# Altium schematic sheet Sobel_FPGA_Block (1).SchDoc
size A1; SheetNumber: 1; SheetTotal: 1
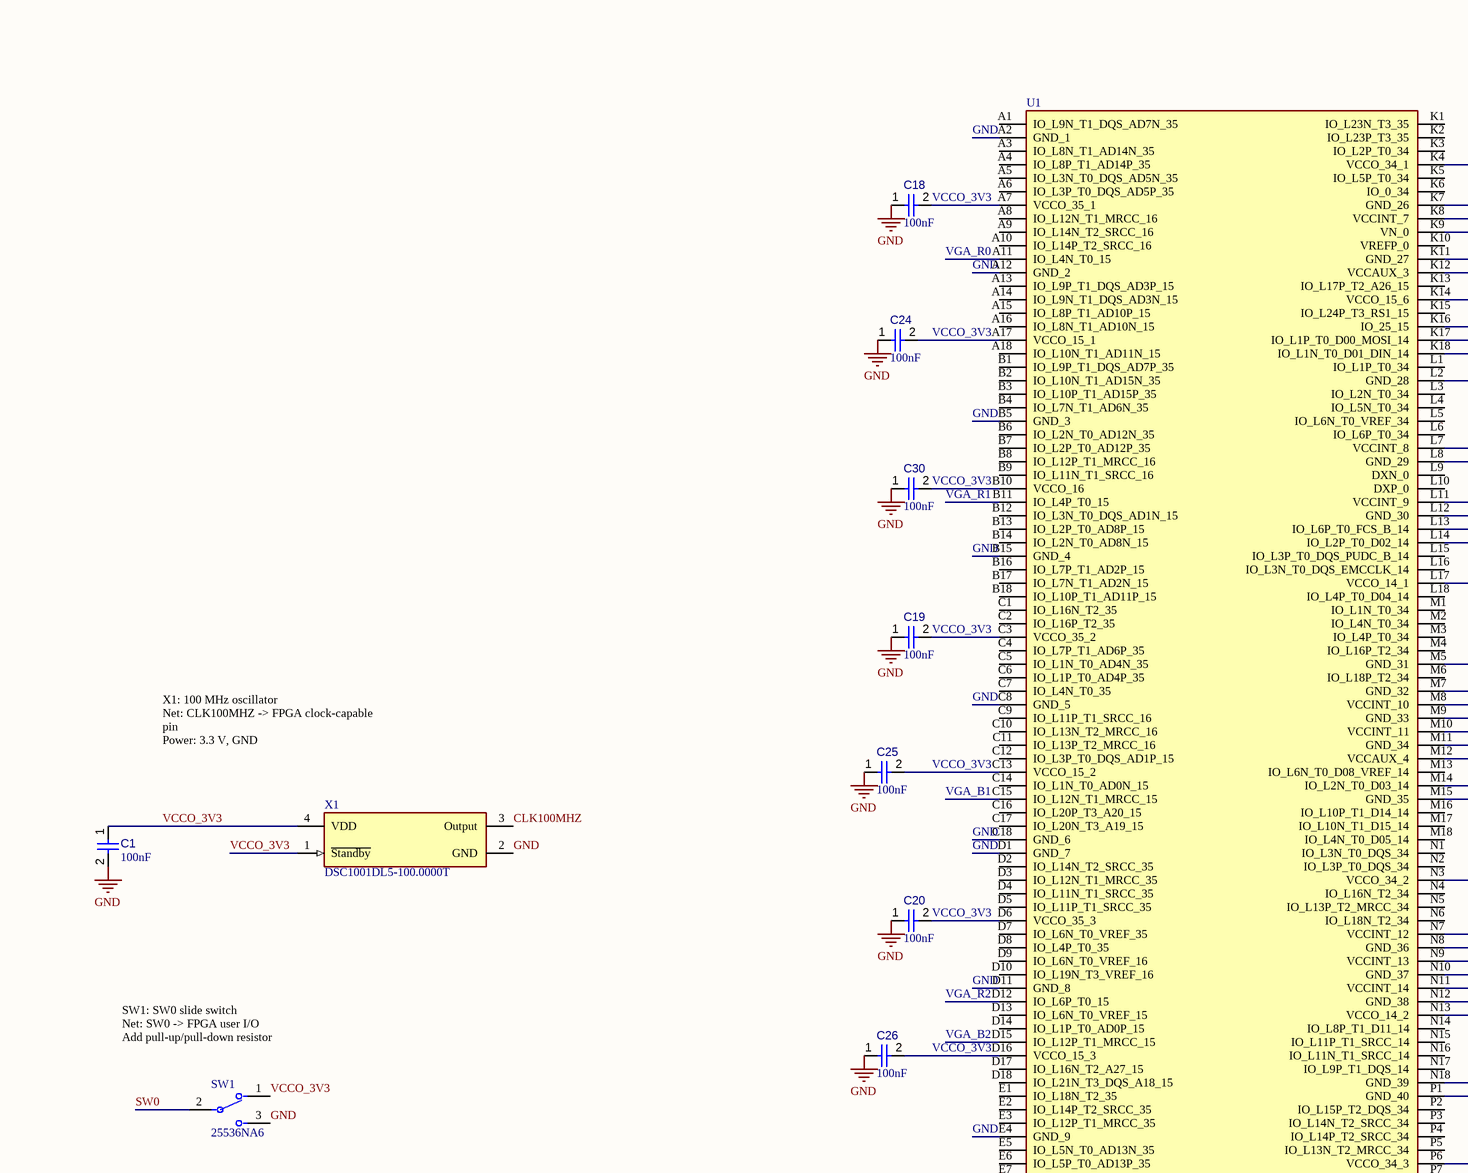
[diagram p0: Sobel_FPGA_Block (1).SchDoc, top left]
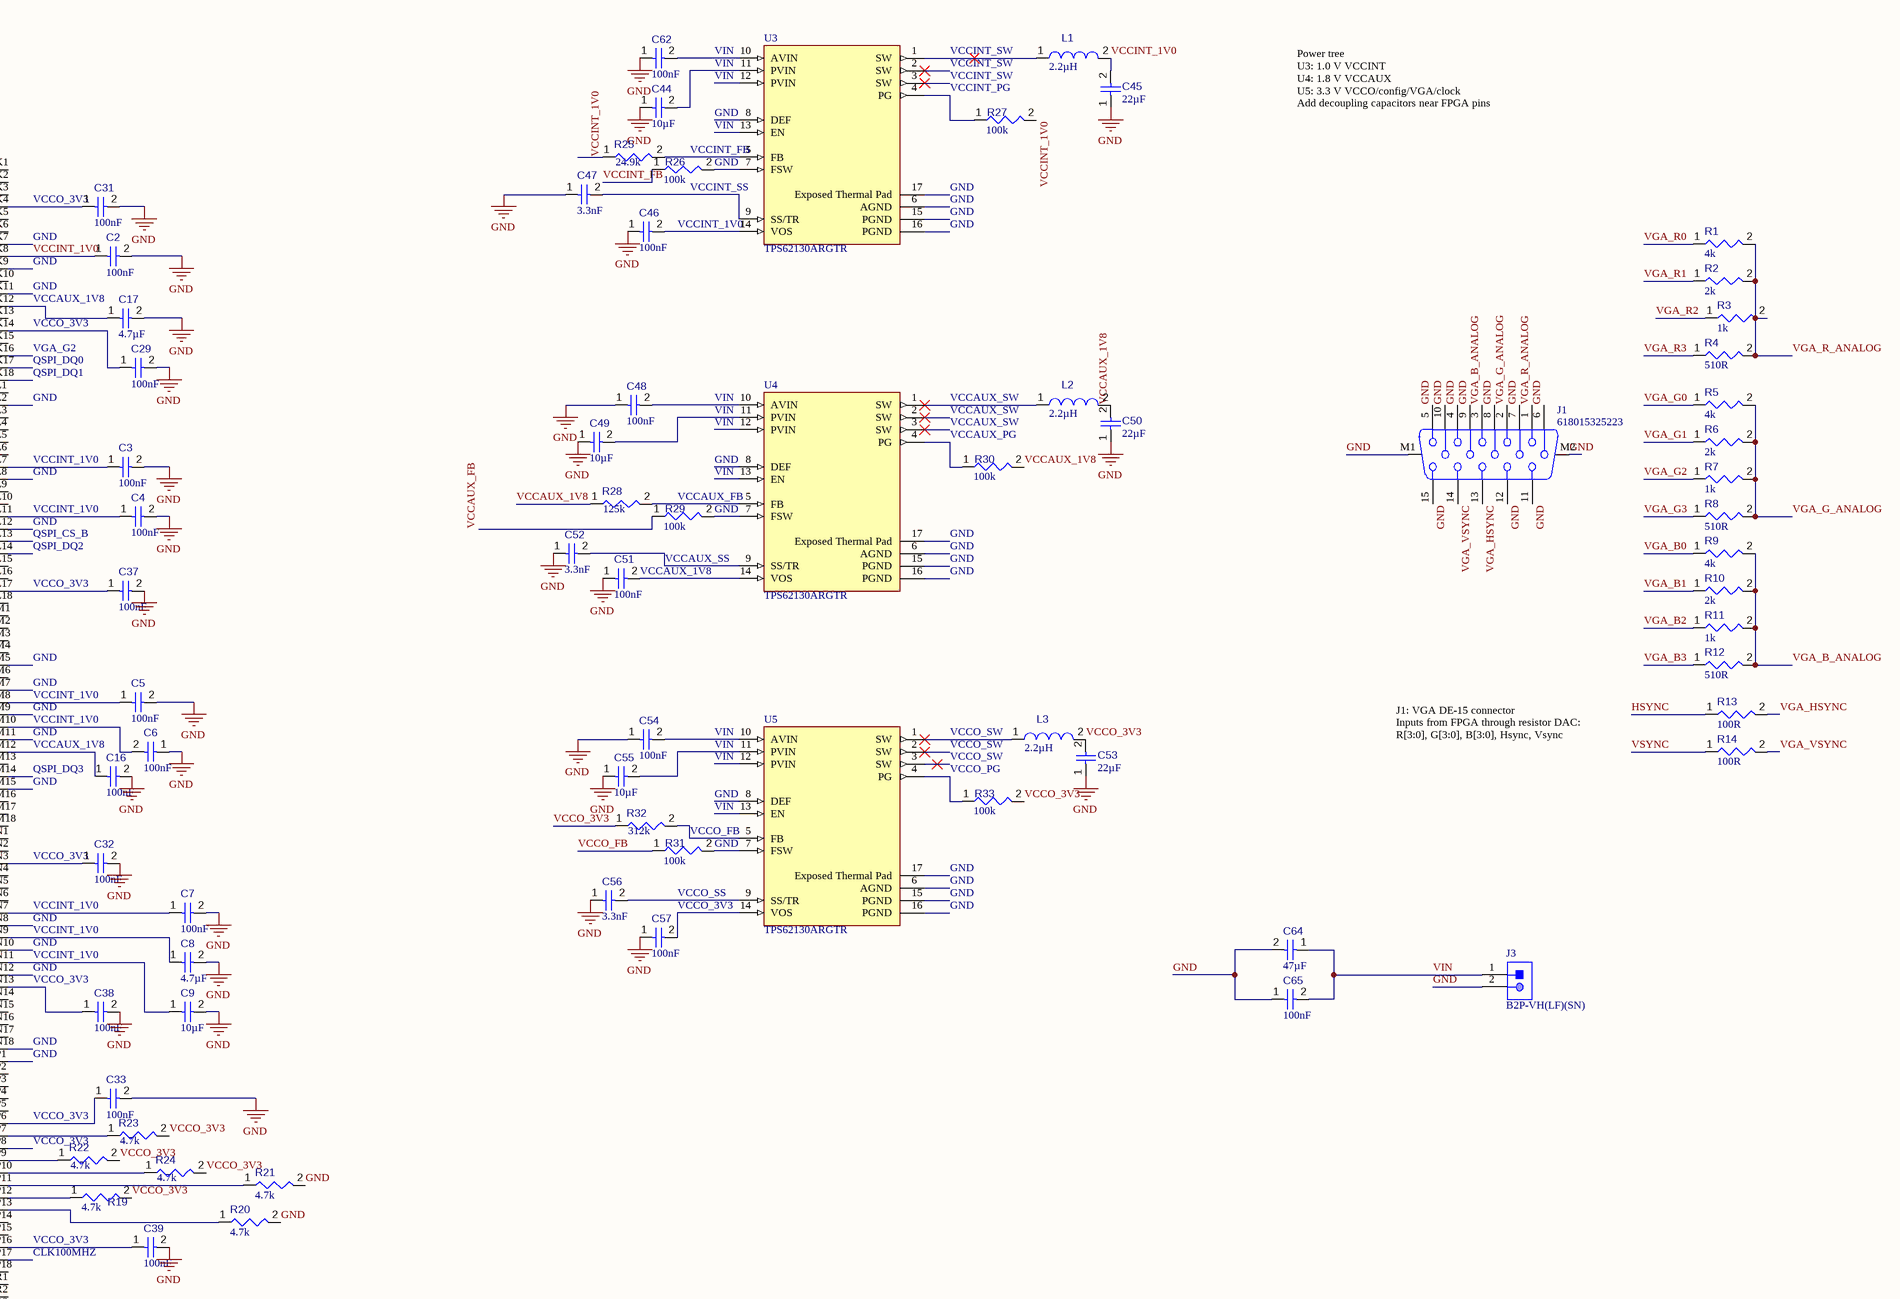
[diagram p1: Sobel_FPGA_Block (1).SchDoc, top right]
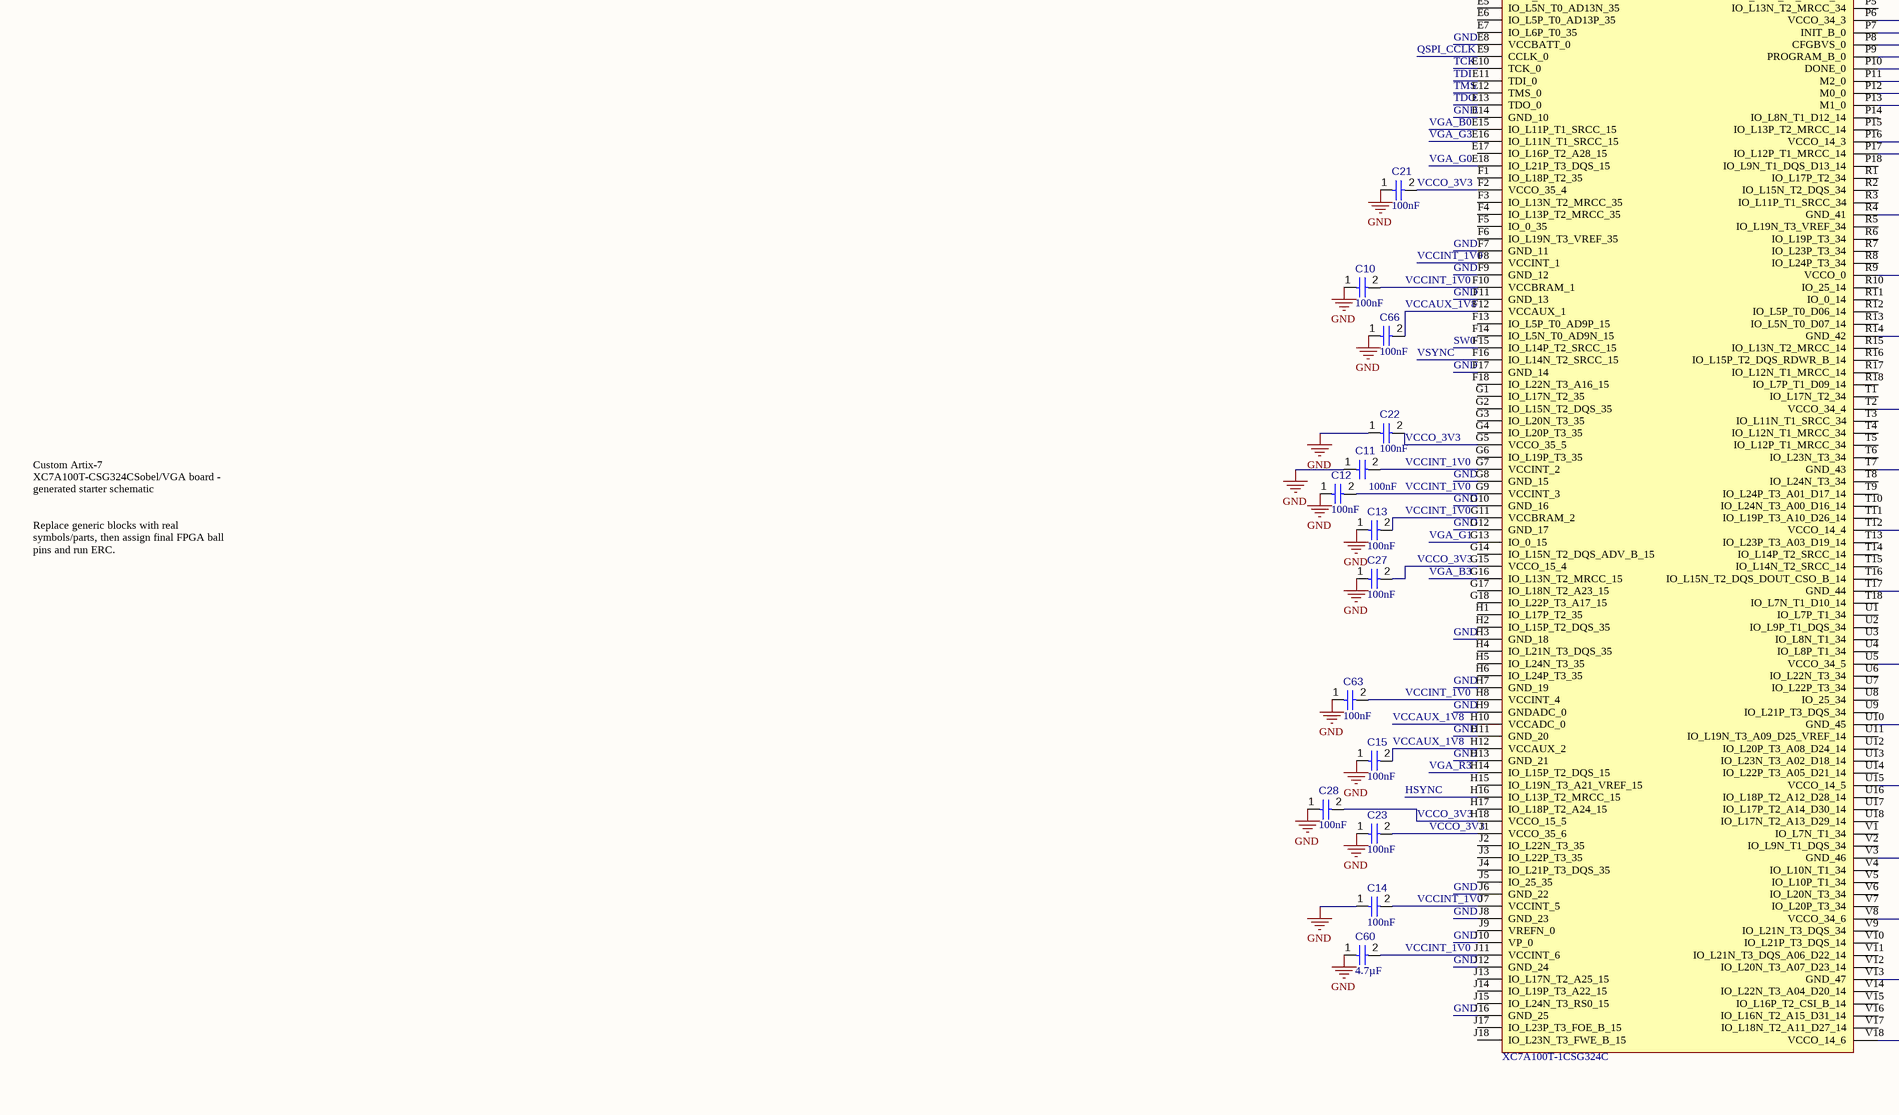
[diagram p2: Sobel_FPGA_Block (1).SchDoc, bottom left]
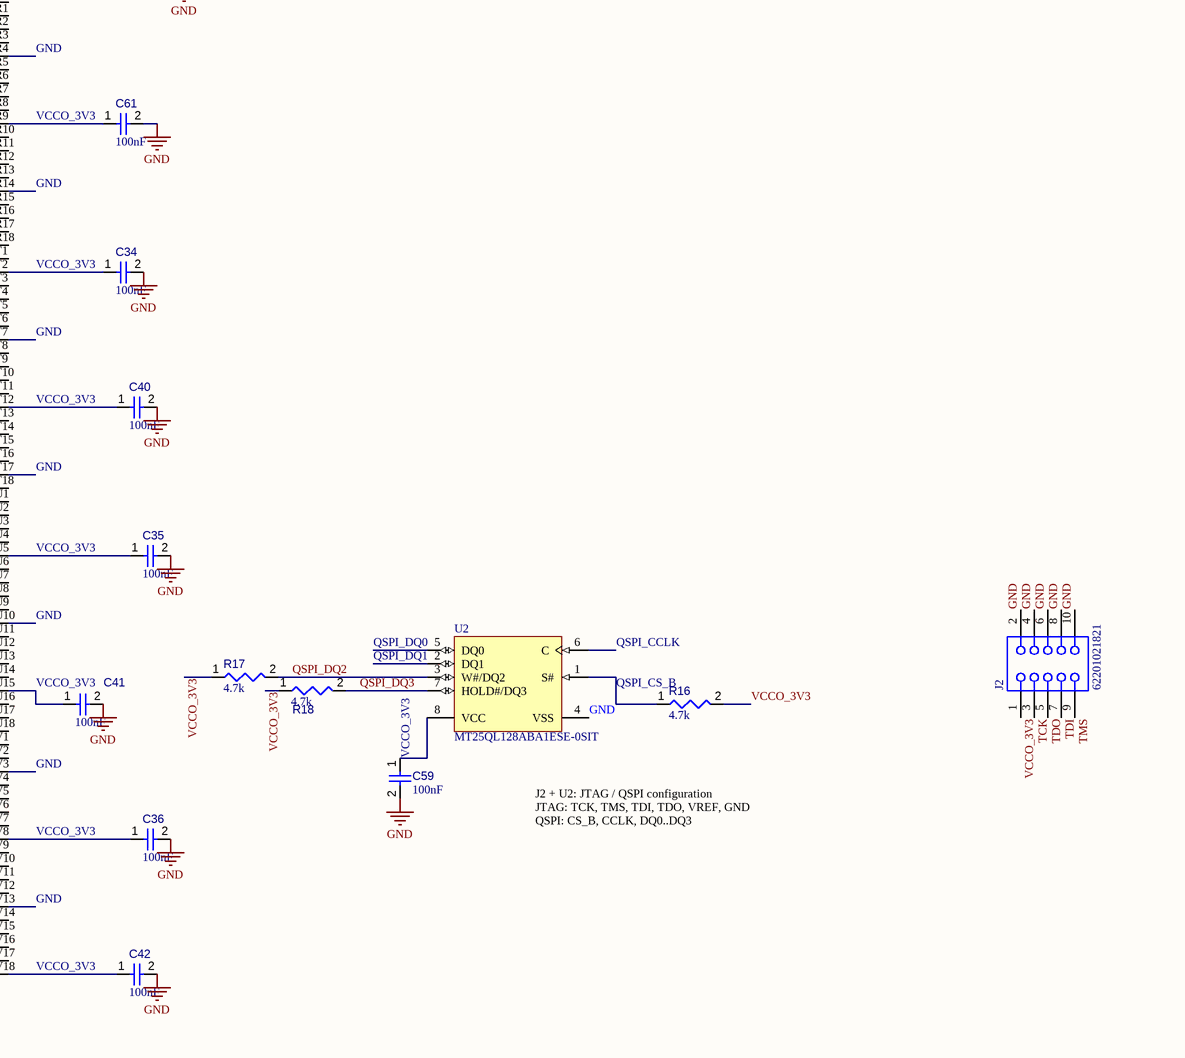
[diagram p3: Sobel_FPGA_Block (1).SchDoc, bottom right]

## Parts
C1  value 100nF  [CAPC1005X56X25NL10T15]  (hidden comment: Capacitor 6.8 nF +/- 10% 16 V 0402)
C2  value 100nF  [CAPC1005X56X25NL10T15]  (hidden comment: Capacitor 6.8 nF +/- 10% 16 V 0402)
C3  value 100nF  [CAPC1005X56X25NL10T15]  (hidden comment: Capacitor 6.8 nF +/- 10% 16 V 0402)
C4  value 100nF  [CAPC1005X56X25NL10T15]  (hidden comment: Capacitor 6.8 nF +/- 10% 16 V 0402)
C5  value 100nF  [CAPC1005X56X25NL10T15]  (hidden comment: Capacitor 6.8 nF +/- 10% 16 V 0402)
C6  value 100nF  [CAPC1005X56X25NL10T15]  (hidden comment: Capacitor 6.8 nF +/- 10% 16 V 0402)
C7  value 100nF  [CAPC1005X56X25NL10T15]  (hidden comment: Capacitor 6.8 nF +/- 10% 16 V 0402)
C8  value 4.7µF  [CAPC3216X180X50NL20T25]  (hidden comment: Capacitor 10 uF +/- 10% 16 V 1206)
C9  value 10µF  [CAPC3216X180X50NL20T25]  (hidden comment: Capacitor 10 uF +/- 10% 16 V 1206)
C10  value 100nF  [CAPC1005X56X25NL10T15]  (hidden comment: Capacitor 6.8 nF +/- 10% 16 V 0402)
C11  value 100nF  [CAPC1005X56X25NL10T15]  (hidden comment: Capacitor 6.8 nF +/- 10% 16 V 0402)
C12  value 100nF  [CAPC1005X56X25NL10T15]  (hidden comment: Capacitor 6.8 nF +/- 10% 16 V 0402)
C13  value 100nF  [CAPC1005X56X25NL10T15]  (hidden comment: Capacitor 6.8 nF +/- 10% 16 V 0402)
C14  value 100nF  [CAPC1005X56X25NL10T15]  (hidden comment: Capacitor 6.8 nF +/- 10% 16 V 0402)
C15  value 100nF  [CAPC1005X56X25NL10T15]  (hidden comment: Capacitor 6.8 nF +/- 10% 16 V 0402)
C16  value 100nF  [CAPC1005X56X25NL10T15]  (hidden comment: Capacitor 6.8 nF +/- 10% 16 V 0402)
C17  value 4.7µF  [CAPC3216X180X50NL20T25]  (hidden comment: Capacitor 10 uF +/- 10% 16 V 1206)
C18  value 100nF  [CAPC1005X56X25NL10T15]  (hidden comment: Capacitor 6.8 nF +/- 10% 16 V 0402)
C19  value 100nF  [CAPC1005X56X25NL10T15]  (hidden comment: Capacitor 6.8 nF +/- 10% 16 V 0402)
C20  value 100nF  [CAPC1005X56X25NL10T15]  (hidden comment: Capacitor 6.8 nF +/- 10% 16 V 0402)
C21  value 100nF  [CAPC1005X56X25NL10T15]  (hidden comment: Capacitor 6.8 nF +/- 10% 16 V 0402)
C22  value 100nF  [CAPC1005X56X25NL10T15]  (hidden comment: Capacitor 6.8 nF +/- 10% 16 V 0402)
C23  value 100nF  [CAPC1005X56X25NL10T15]  (hidden comment: Capacitor 6.8 nF +/- 10% 16 V 0402)
C24  value 100nF  [CAPC1005X56X25NL10T15]  (hidden comment: Capacitor 6.8 nF +/- 10% 16 V 0402)
C25  value 100nF  [CAPC1005X56X25NL10T15]  (hidden comment: Capacitor 6.8 nF +/- 10% 16 V 0402)
C26  value 100nF  [CAPC1005X56X25NL10T15]  (hidden comment: Capacitor 6.8 nF +/- 10% 16 V 0402)
C27  value 100nF  [CAPC1005X56X25NL10T15]  (hidden comment: Capacitor 6.8 nF +/- 10% 16 V 0402)
C28  value 100nF  [CAPC1005X56X25NL10T15]  (hidden comment: Capacitor 6.8 nF +/- 10% 16 V 0402)
C29  value 100nF  [CAPC1005X56X25NL10T15]  (hidden comment: Capacitor 6.8 nF +/- 10% 16 V 0402)
C30  value 100nF  [CAPC1005X56X25NL10T15]  (hidden comment: Capacitor 6.8 nF +/- 10% 16 V 0402)
C31  value 100nF  [CAPC1005X56X25NL10T15]  (hidden comment: Capacitor 6.8 nF +/- 10% 16 V 0402)
C32  value 100nF  [CAPC1005X56X25NL10T15]  (hidden comment: Capacitor 6.8 nF +/- 10% 16 V 0402)
C33  value 100nF  [CAPC1005X56X25NL10T15]  (hidden comment: Capacitor 6.8 nF +/- 10% 16 V 0402)
C34  value 100nF  [CAPC1005X56X25NL10T15]  (hidden comment: Capacitor 6.8 nF +/- 10% 16 V 0402)
C35  value 100nF  [CAPC1005X56X25NL10T15]  (hidden comment: Capacitor 6.8 nF +/- 10% 16 V 0402)
C36  value 100nF  [CAPC1005X56X25NL10T15]  (hidden comment: Capacitor 6.8 nF +/- 10% 16 V 0402)
C37  value 100nF  [CAPC1005X56X25NL10T15]  (hidden comment: Capacitor 6.8 nF +/- 10% 16 V 0402)
C38  value 100nF  [CAPC1005X56X25NL10T15]  (hidden comment: Capacitor 6.8 nF +/- 10% 16 V 0402)
C39  value 100nF  [CAPC1005X56X25NL10T15]  (hidden comment: Capacitor 6.8 nF +/- 10% 16 V 0402)
C40  value 100nF  [CAPC1005X56X25NL10T15]  (hidden comment: Capacitor 6.8 nF +/- 10% 16 V 0402)
C41  value 100nF  [CAPC1005X56X25NL10T15]  (hidden comment: Capacitor 6.8 nF +/- 10% 16 V 0402)
C42  value 100nF  [CAPC1005X56X25NL10T15]  (hidden comment: Capacitor 6.8 nF +/- 10% 16 V 0402)
C44  value 10µF  [CAPC3216X180X50NL20T25]  (hidden comment: Capacitor 10 uF +/- 10% 16 V 1206)
C45  value 22µF  [CAPC3216X180X50NL20T25]  (hidden comment: Capacitor 10 uF +/- 10% 16 V 1206)
C46  value 100nF  [CAPC1005X56X25NL10T15]  (hidden comment: Capacitor 6.8 nF +/- 10% 16 V 0402)
C47  value 3.3nF  [CAPC1005X56X25NL10T15]  (hidden comment: Capacitor 6.8 nF +/- 10% 16 V 0402)
C48  value 100nF  [CAPC1005X56X25NL10T15]  (hidden comment: Capacitor 6.8 nF +/- 10% 16 V 0402)
C49  value 10µF  [CAPC3216X180X50NL20T25]  (hidden comment: Capacitor 10 uF +/- 10% 16 V 1206)
C50  value 22µF  [CAPC3216X180X50NL20T25]  (hidden comment: Capacitor 10 uF +/- 10% 16 V 1206)
C51  value 100nF  [CAPC1005X56X25NL10T15]  (hidden comment: Capacitor 6.8 nF +/- 10% 16 V 0402)
C52  value 3.3nF  [CAPC1005X56X25NL10T15]  (hidden comment: Capacitor 6.8 nF +/- 10% 16 V 0402)
C53  value 22µF  [CAPC3216X180X50NL20T25]  (hidden comment: Capacitor 10 uF +/- 10% 16 V 1206)
C54  value 100nF  [CAPC1005X56X25NL10T15]  (hidden comment: Capacitor 6.8 nF +/- 10% 16 V 0402)
C55  value 10µF  [CAPC3216X180X50NL20T25]  (hidden comment: Capacitor 10 uF +/- 10% 16 V 1206)
C56  value 3.3nF  [CAPC1005X56X25NL10T15]  (hidden comment: Capacitor 6.8 nF +/- 10% 16 V 0402)
C57  value 100nF  [CAPC1005X56X25NL10T15]  (hidden comment: Capacitor 6.8 nF +/- 10% 16 V 0402)
C59  value 100nF  [CAPC1005X56X25NL10T15]  (hidden comment: Capacitor 6.8 nF +/- 10% 16 V 0402)
C60  value 4.7µF  [CAPC3216X180X50NL20T25]  (hidden comment: Capacitor 10 uF +/- 10% 16 V 1206)
C61  value 100nF  [CAPC1005X56X25NL10T15]  (hidden comment: Capacitor 6.8 nF +/- 10% 16 V 0402)
C62  value 100nF  [CAPC1005X56X25NL10T15]  (hidden comment: Capacitor 6.8 nF +/- 10% 16 V 0402)
C63  value 100nF  [CAPC1005X56X25NL10T15]  (hidden comment: Capacitor 6.8 nF +/- 10% 16 V 0402)
C64  value 47µF  [CAPC3216X180X50NL20T25]  (hidden comment: Capacitor 10 uF +/- 10% 16 V 1206)
C65  value 100nF  [CAPC1005X56X25NL10T15]  (hidden comment: Capacitor 6.8 nF +/- 10% 16 V 0402)
C66  value 100nF  [CAPC1005X56X25NL10T15]  (hidden comment: Capacitor 6.8 nF +/- 10% 16 V 0402)
J1  618015325223  [618015325223]
J2  62201021821  [62201021821]
J3  B2P-VH(LF)(SN)  [JST-B2P-VH(LF)(SN)_V]
L1  value 2.2µH  [SUSUMU-PCMB063T_V]  (hidden comment: PCMB063T-2R2MS)
L2  value 2.2µH  [SUSUMU-PCMB063T_V]  (hidden comment: PCMB063T-2R2MS)
L3  value 2.2µH  [SUSUMU-PCMB063T_V]  (hidden comment: PCMB063T-2R2MS)
R1  value 4k  [RESA60-630X240]  (hidden comment: MFR-25FBF52-475R)
R2  value 2k  [RESA60-630X240]  (hidden comment: MFR-25FBF52-475R)
R3  value 1k  [RESA60-630X240]  (hidden comment: MFR-25FBF52-475R)
R4  value 510R  [RESA60-630X240]  (hidden comment: MFR-25FBF52-475R)
R5  value 4k  [RESA60-630X240]  (hidden comment: MFR-25FBF52-475R)
R6  value 2k  [RESA60-630X240]  (hidden comment: MFR-25FBF52-475R)
R7  value 1k  [RESA60-630X240]  (hidden comment: MFR-25FBF52-475R)
R8  value 510R  [RESA60-630X240]  (hidden comment: MFR-25FBF52-475R)
R9  value 4k  [RESA60-630X240]  (hidden comment: MFR-25FBF52-475R)
R10  value 2k  [RESA60-630X240]  (hidden comment: MFR-25FBF52-475R)
R11  value 1k  [RESA60-630X240]  (hidden comment: MFR-25FBF52-475R)
R12  value 510R  [RESA60-630X240]  (hidden comment: MFR-25FBF52-475R)
R13  value 100R  [RESA60-630X240]  (hidden comment: MFR-25FBF52-475R)
R14  value 100R  [RESA60-630X240]  (hidden comment: MFR-25FBF52-475R)
R16  value 4.7k  [RESC0402(1005)_L]  (hidden comment: 84D5KR2F)
R17  value 4.7k  [RESC0402(1005)_L]  (hidden comment: 84D5KR2F)
R18  value 4.7k  [RESC0402(1005)_L]  (hidden comment: 84D5KR2F)
R19  value 4.7k  [RESC0402(1005)_L]  (hidden comment: 84D5KR2F)
R20  value 4.7k  [RESC0402(1005)_L]  (hidden comment: 84D5KR2F)
R21  value 4.7k  [RESC0402(1005)_L]  (hidden comment: 84D5KR2F)
R22  value 4.7k  [RESC0402(1005)_L]  (hidden comment: 84D5KR2F)
R23  value 4.7k  [RESC0402(1005)_L]  (hidden comment: 84D5KR2F)
R24  value 4.7k  [RESC0402(1005)_L]  (hidden comment: 84D5KR2F)
R25  value 24.9k  [RESC0402(1005)_L]  (hidden comment: 84D5KR2F)
R26  value 100k  [RESC0402(1005)_L]  (hidden comment: 84D5KR2F)
R27  value 100k  [RESC0402(1005)_L]  (hidden comment: 84D5KR2F)
R28  value 125k  [RESC0402(1005)_L]  (hidden comment: 84D5KR2F)
R29  value 100k  [RESC0402(1005)_L]  (hidden comment: 84D5KR2F)
R30  value 100k  [RESC0402(1005)_L]  (hidden comment: 84D5KR2F)
R31  value 100k  [RESC0402(1005)_L]  (hidden comment: 84D5KR2F)
R32  value 312k  [RESC0402(1005)_L]  (hidden comment: 84D5KR2F)
R33  value 100k  [RESC0402(1005)_L]  (hidden comment: 84D5KR2F)
SW1  25536NA6  [FP-25536NA6-0]
U1  XC7A100T-1CSG324C  [CSG324_XIL]
U2  MT25QL128ABA1ESE-0SIT  [MICT-SE-8_L]
U3  TPS62130ARGTR  [FP-RGT0016C-IPC_C]
U4  TPS62130ARGTR  [FP-RGT0016C-IPC_C]
U5  TPS62130ARGTR  [FP-RGT0016C-IPC_C]
X1  DSC1001DL5-100.0000T  [FP-CDFN2520-4LD-PL-1-MFG]

## Nets
GND: C1.2 C2.2 C3.2 C4.2 C5.2 C6.1 C7.2 C8.2 C9.2 C10.1 C11.1 C12.1 C13.1 C14.1 C15.1 C16.2 C17.2 C18.1 C19.1 C20.1 C21.1 C22.1 C23.1 C24.1 C25.1 C26.1 C27.1 C28.1 C29.2 C30.1 C31.2 C32.2 C33.2 C34.2 C35.2 C36.2 C37.2 C38.2 C39.2 C40.2 C41.2 C42.2 C44.1 C45.1 C46.1 C47.1 C48.1 C49.1 C50.1 C51.1 C52.1 C53.1 C54.1 C55.1 C56.1 C57.1 C59.2 C60.1 C61.2 C62.1 C63.1 C64.2 C65.1 C66.1 J1.4 J1.5 J1.6 J1.7 J1.8 J1.9 J1.10 J1.11 J1.12 J1.15 J1.M1 J1.M2 J2.2 J2.4 J2.6 J2.8 J2.10 J3.2 R20.2 R21.2 R26.2 R29.2 R31.2 SW1.3 U1.A2(GND_1) U1.A12(GND_2) U1.B5(GND_3) U1.B15(GND_4) U1.C8(GND_5) U1.C18(GND_6) U1.D1(GND_7) U1.D11(GND_8) U1.E4(GND_9) U1.E8(VCCBATT_0) U1.E14(GND_10) U1.F7(GND_11) U1.F9(GND_12) U1.F11(GND_13) U1.F17(GND_14) U1.G8(GND_15) U1.G10(GND_16) U1.G12(GND_17) U1.H3(GND_18) U1.H7(GND_19) U1.H9(GNDADC_0) U1.H11(GND_20) U1.H13(GND_21) U1.J6(GND_22) U1.J8(GND_23) U1.J10(VP_0) U1.J12(GND_24) U1.J16(GND_25) U1.K7(GND_26) U1.K9(VN_0) U1.K11(GND_27) U1.L2(GND_28) U1.L8(GND_29) U1.L12(GND_30) U1.M5(GND_31) U1.M7(GND_32) U1.M9(GND_33) U1.M11(GND_34) U1.M15(GND_35) U1.N8(GND_36) U1.N10(GND_37) U1.N12(GND_38) U1.N18(GND_39) U1.P1(GND_40) U1.R4(GND_41) U1.R14(GND_42) U1.T7(GND_43) U1.T17(GND_44) U1.U10(GND_45) U1.V3(GND_46) U1.V13(GND_47) U2.4(VSS) U3.6(AGND) U3.7(FSW) U3.8(DEF) U3.15(PGND) U3.16(PGND) U3.17(Exposed_Thermal_Pad) U4.6(AGND) U4.7(FSW) U4.8(DEF) U4.15(PGND) U4.16(PGND) U4.17(Exposed_Thermal_Pad) U5.6(AGND) U5.7(FSW) U5.8(DEF) U5.15(PGND) U5.16(PGND) U5.17(Exposed_Thermal_Pad) X1.2(GND)
CLK100MHZ: U1.P17(IO_L12P_T1_MRCC_14) X1.3(Output)
HSYNC: R13.1 U1.H16(IO_L13P_T2_MRCC_15)
QSPI_CCLK: U1.E9(CCLK_0) U2.6(C)
QSPI_CS_B: R16.1 U1.L13(IO_L6P_T0_FCS_B_14) U2.1(S#)
QSPI_DQ0: U1.K17(IO_L1P_T0_D00_MOSI_14) U2.5(DQ0)
QSPI_DQ1: U1.K18(IO_L1N_T0_D01_DIN_14) U2.2(DQ1)
QSPI_DQ2: R17.2 U1.L14(IO_L2P_T0_D02_14) U2.3(W#/DQ2)
QSPI_DQ3: R18.2 U1.M14(IO_L2N_T0_D03_14) U2.7(HOLD#/DQ3)
SW0: SW1.2 U1.F15(IO_L14P_T2_SRCC_15)
TCK: J2.3 U1.E10(TCK_0)
TDI: J2.7 U1.E11(TDI_0)
TDO: J2.5 U1.E13(TDO_0)
TMS: J2.9 U1.E12(TMS_0)
VCCAUX_1V8: C15.2 C16.1 C17.1 C50.2 C51.2 C66.2 L2.2 R28.1 R30.2 U1.F12(VCCAUX_1) U1.H10(VCCADC_0) U1.H12(VCCAUX_2) U1.K12(VCCAUX_3) U1.M12(VCCAUX_4) U4.14(VOS)
VCCAUX_FB: R28.2 R29.1 U4.5(FB)
VCCAUX_PG: R30.1 U4.4(PG)
VCCAUX_SS: C52.2 U4.9(SS/TR)
VCCAUX_SW: L2.1 U4.1(SW) U4.2(SW) U4.3(SW)
VCCINT_1V0: C2.1 C3.1 C4.1 C5.1 C6.2 C7.1 C8.1 C9.1 C10.2 C11.2 C12.2 C13.2 C14.2 C45.2 C46.2 C60.2 C63.2 L1.2 R25.1 R27.2 U1.F8(VCCINT_1) U1.F10(VCCBRAM_1) U1.G7(VCCINT_2) U1.G9(VCCINT_3) U1.G11(VCCBRAM_2) U1.H8(VCCINT_4) U1.J7(VCCINT_5) U1.J11(VCCINT_6) U1.K8(VCCINT_7) U1.L7(VCCINT_8) U1.L11(VCCINT_9) U1.M8(VCCINT_10) U1.M10(VCCINT_11) U1.N7(VCCINT_12) U1.N9(VCCINT_13) U1.N11(VCCINT_14) U3.14(VOS)
VCCINT_FB: R25.2 R26.1 U3.5(FB)
VCCINT_PG: R27.1 U3.4(PG)
VCCINT_SS: C47.2 U3.9(SS/TR)
VCCINT_SW: L1.1 U3.1(SW) U3.2(SW) U3.3(SW)
VCCO_3V3: C1.1 C18.2 C19.2 C20.2 C21.2 C22.2 C23.2 C24.2 C25.2 C26.2 C27.2 C28.2 C29.1 C30.2 C31.1 C32.1 C33.1 C34.1 C35.1 C36.1 C37.1 C38.1 C39.1 C40.1 C41.1 C42.1 C53.2 C57.2 C59.1 C61.1 J2.1 L3.2 R16.2 R17.1 R18.1 R19.2 R22.2 R23.2 R24.2 R32.1 R33.2 SW1.1 U1.A7(VCCO_35_1) U1.A17(VCCO_15_1) U1.B10(VCCO_16) U1.C3(VCCO_35_2) U1.C13(VCCO_15_2) U1.D6(VCCO_35_3) U1.D16(VCCO_15_3) U1.F2(VCCO_35_4) U1.G5(VCCO_35_5) U1.G15(VCCO_15_4) U1.H18(VCCO_15_5) U1.J1(VCCO_35_6) U1.K4(VCCO_34_1) U1.K14(VCCO_15_6) U1.L17(VCCO_14_1) U1.N3(VCCO_34_2) U1.N13(VCCO_14_2) U1.P6(VCCO_34_3) U1.P8(CFGBVS_0) U1.P16(VCCO_14_3) U1.R9(VCCO_0) U1.T2(VCCO_34_4) U1.T12(VCCO_14_4) U1.U5(VCCO_34_5) U1.U15(VCCO_14_5) U1.V8(VCCO_34_6) U1.V18(VCCO_14_6) U2.8(VCC) U5.14(VOS) X1.1(~{Standby}) X1.4(VDD)
VCCO_FB: R31.1 R32.2 U5.5(FB)
VCCO_PG: R33.1 U5.4(PG)
VCCO_SS: C56.2 U5.9(SS/TR)
VCCO_SW: L3.1 U5.1(SW) U5.2(SW) U5.3(SW)
VGA_B0: R9.1 U1.E15(IO_L11P_T1_SRCC_15)
VGA_B1: R10.1 U1.C15(IO_L12N_T1_MRCC_15)
VGA_B2: R11.1 U1.D15(IO_L12P_T1_MRCC_15)
VGA_B3: R12.1 U1.G16(IO_L13N_T2_MRCC_15)
VGA_B_ANALOG: J1.3 R9.2 R10.2 R11.2 R12.2
VGA_G0: R5.1 U1.E18(IO_L21P_T3_DQS_15)
VGA_G1: R6.1 U1.G13(IO_0_15)
VGA_G2: R7.1 U1.K16(IO_25_15)
VGA_G3: R8.1 U1.E16(IO_L11N_T1_SRCC_15)
VGA_G_ANALOG: J1.2 R5.2 R6.2 R7.2 R8.2
VGA_HSYNC: J1.13 R13.2
VGA_R0: R1.1 U1.A11(IO_L4N_T0_15)
VGA_R1: R2.1 U1.B11(IO_L4P_T0_15)
VGA_R2: R3.1 U1.D12(IO_L6P_T0_15)
VGA_R3: R4.1 U1.H14(IO_L15P_T2_DQS_15)
VGA_R_ANALOG: J1.1 R1.2 R2.2 R3.2 R4.2
VGA_VSYNC: J1.14 R14.2
VIN: C44.2 C48.2 C49.2 C54.2 C55.2 C62.2 C64.1 C65.2 J3.1 U3.10(AVIN) U3.11(PVIN) U3.12(PVIN) U3.13(EN) U4.10(AVIN) U4.11(PVIN) U4.12(PVIN) U4.13(EN) U5.10(AVIN) U5.11(PVIN) U5.12(PVIN) U5.13(EN)
VSYNC: R14.1 U1.F16(IO_L14N_T2_SRCC_15)
NetR19_1: R19.1 U1.P12(M0_0)
NetR20_1: R20.1 U1.P13(M1_0)
NetR21_1: R21.1 U1.P11(M2_0)
NetR22_1: R22.1 U1.P9(PROGRAM_B_0)
NetR23_1: R23.1 U1.P7(INIT_B_0)
NetR24_1: R24.1 U1.P10(DONE_0)

Not connected (* = marked no-connect by the designer): U1 A1(IO_L9N_T1_DQS_AD7N_35) A3(IO_L8N_T1_AD14N_35) A4(IO_L8P_T1_AD14P_35) A5(IO_L3N_T0_DQS_AD5N_35) A6(IO_L3P_T0_DQS_AD5P_35) A8(IO_L12N_T1_MRCC_16) A9(IO_L14N_T2_SRCC_16) A10(IO_L14P_T2_SRCC_16) A13(IO_L9P_T1_DQS_AD3P_15) A14(IO_L9N_T1_DQS_AD3N_15) A15(IO_L8P_T1_AD10P_15) A16(IO_L8N_T1_AD10N_15) A18(IO_L10N_T1_AD11N_15) B1(IO_L9P_T1_DQS_AD7P_35) B2(IO_L10N_T1_AD15N_35) B3(IO_L10P_T1_AD15P_35) B4(IO_L7N_T1_AD6N_35) B6(IO_L2N_T0_AD12N_35) B7(IO_L2P_T0_AD12P_35) B8(IO_L12P_T1_MRCC_16) B9(IO_L11N_T1_SRCC_16) B12(IO_L3N_T0_DQS_AD1N_15) B13(IO_L2P_T0_AD8P_15) B14(IO_L2N_T0_AD8N_15) B16(IO_L7P_T1_AD2P_15) B17(IO_L7N_T1_AD2N_15) B18(IO_L10P_T1_AD11P_15) C1(IO_L16N_T2_35) C2(IO_L16P_T2_35) C4(IO_L7P_T1_AD6P_35) C5(IO_L1N_T0_AD4N_35) C6(IO_L1P_T0_AD4P_35) C7(IO_L4N_T0_35) C9(IO_L11P_T1_SRCC_16) C10(IO_L13N_T2_MRCC_16) C11(IO_L13P_T2_MRCC_16) C12(IO_L3P_T0_DQS_AD1P_15) C14(IO_L1N_T0_AD0N_15) C16(IO_L20P_T3_A20_15) C17(IO_L20N_T3_A19_15) D2(IO_L14N_T2_SRCC_35) D3(IO_L12N_T1_MRCC_35) D4(IO_L11N_T1_SRCC_35) D5(IO_L11P_T1_SRCC_35) D7(IO_L6N_T0_VREF_35) D8(IO_L4P_T0_35) D9(IO_L6N_T0_VREF_16) D10(IO_L19N_T3_VREF_16) D13(IO_L6N_T0_VREF_15) D14(IO_L1P_T0_AD0P_15) D17(IO_L16N_T2_A27_15) D18(IO_L21N_T3_DQS_A18_15) E1(IO_L18N_T2_35) E2(IO_L14P_T2_SRCC_35) E3(IO_L12P_T1_MRCC_35) E5(IO_L5N_T0_AD13N_35) E6(IO_L5P_T0_AD13P_35) E7(IO_L6P_T0_35) E17(IO_L16P_T2_A28_15) F1(IO_L18P_T2_35) F3(IO_L13N_T2_MRCC_35) F4(IO_L13P_T2_MRCC_35) F5(IO_0_35) F6(IO_L19N_T3_VREF_35) F13(IO_L5P_T0_AD9P_15) F14(IO_L5N_T0_AD9N_15) F18(IO_L22N_T3_A16_15) G1(IO_L17N_T2_35) G2(IO_L15N_T2_DQS_35) G3(IO_L20N_T3_35) G4(IO_L20P_T3_35) G6(IO_L19P_T3_35) G14(IO_L15N_T2_DQS_ADV_B_15) G17(IO_L18N_T2_A23_15) G18(IO_L22P_T3_A17_15) H1(IO_L17P_T2_35) H2(IO_L15P_T2_DQS_35) H4(IO_L21N_T3_DQS_35) H5(IO_L24N_T3_35) H6(IO_L24P_T3_35) H15(IO_L19N_T3_A21_VREF_15) H17(IO_L18P_T2_A24_15) J2(IO_L22N_T3_35) J3(IO_L22P_T3_35) J4(IO_L21P_T3_DQS_35) J5(IO_25_35) J9(VREFN_0) J13(IO_L17N_T2_A25_15) J14(IO_L19P_T3_A22_15) J15(IO_L24N_T3_RS0_15) J17(IO_L23P_T3_FOE_B_15) J18(IO_L23N_T3_FWE_B_15) K1(IO_L23N_T3_35) K2(IO_L23P_T3_35) K3(IO_L2P_T0_34) K5(IO_L5P_T0_34) K6(IO_0_34) K10(VREFP_0) K13(IO_L17P_T2_A26_15) K15(IO_L24P_T3_RS1_15) L1(IO_L1P_T0_34) L3(IO_L2N_T0_34) L4(IO_L5N_T0_34) L5(IO_L6N_T0_VREF_34) L6(IO_L6P_T0_34) L9(DXN_0) L10(DXP_0) L15(IO_L3P_T0_DQS_PUDC_B_14) L16(IO_L3N_T0_DQS_EMCCLK_14) L18(IO_L4P_T0_D04_14) M1(IO_L1N_T0_34) M2(IO_L4N_T0_34) M3(IO_L4P_T0_34) M4(IO_L16P_T2_34) M6(IO_L18P_T2_34) M13(IO_L6N_T0_D08_VREF_14) M16(IO_L10P_T1_D14_14) M17(IO_L10N_T1_D15_14) M18(IO_L4N_T0_D05_14) N1(IO_L3N_T0_DQS_34) N2(IO_L3P_T0_DQS_34) N4(IO_L16N_T2_34) N5(IO_L13P_T2_MRCC_34) N6(IO_L18N_T2_34) N14(IO_L8P_T1_D11_14) N15(IO_L11P_T1_SRCC_14) N16(IO_L11N_T1_SRCC_14) N17(IO_L9P_T1_DQS_14) P2(IO_L15P_T2_DQS_34) P3(IO_L14N_T2_SRCC_34) P4(IO_L14P_T2_SRCC_34) P5(IO_L13N_T2_MRCC_34) P14(IO_L8N_T1_D12_14) P15(IO_L13P_T2_MRCC_14) P18(IO_L9N_T1_DQS_D13_14) R1(IO_L17P_T2_34) R2(IO_L15N_T2_DQS_34) R3(IO_L11P_T1_SRCC_34) R5(IO_L19N_T3_VREF_34) R6(IO_L19P_T3_34) R7(IO_L23P_T3_34) R8(IO_L24P_T3_34) R10(IO_25_14) R11(IO_0_14) R12(IO_L5P_T0_D06_14) R13(IO_L5N_T0_D07_14) R15(IO_L13N_T2_MRCC_14) R16(IO_L15P_T2_DQS_RDWR_B_14) R17(IO_L12N_T1_MRCC_14) R18(IO_L7P_T1_D09_14) T1(IO_L17N_T2_34) T3(IO_L11N_T1_SRCC_34) T4(IO_L12N_T1_MRCC_34) T5(IO_L12P_T1_MRCC_34) T6(IO_L23N_T3_34) T8(IO_L24N_T3_34) T9(IO_L24P_T3_A01_D17_14) T10(IO_L24N_T3_A00_D16_14) T11(IO_L19P_T3_A10_D26_14) T13(IO_L23P_T3_A03_D19_14) T14(IO_L14P_T2_SRCC_14) T15(IO_L14N_T2_SRCC_14) T16(IO_L15N_T2_DQS_DOUT_CSO_B_14) T18(IO_L7N_T1_D10_14) U1(IO_L7P_T1_34) U2(IO_L9P_T1_DQS_34) U3(IO_L8N_T1_34) U4(IO_L8P_T1_34) U6(IO_L22N_T3_34) U7(IO_L22P_T3_34) U8(IO_25_34) U9(IO_L21P_T3_DQS_34) U11(IO_L19N_T3_A09_D25_VREF_14) U12(IO_L20P_T3_A08_D24_14) U13(IO_L23N_T3_A02_D18_14) U14(IO_L22P_T3_A05_D21_14) U16(IO_L18P_T2_A12_D28_14) U17(IO_L17P_T2_A14_D30_14) U18(IO_L17N_T2_A13_D29_14) V1(IO_L7N_T1_34) V2(IO_L9N_T1_DQS_34) V4(IO_L10N_T1_34) V5(IO_L10P_T1_34) V6(IO_L20N_T3_34) V7(IO_L20P_T3_34) V9(IO_L21N_T3_DQS_34) V10(IO_L21P_T3_DQS_14) V11(IO_L21N_T3_DQS_A06_D22_14) V12(IO_L20N_T3_A07_D23_14) V14(IO_L22N_T3_A04_D20_14) V15(IO_L16P_T2_CSI_B_14) V16(IO_L16N_T2_A15_D31_14) V17(IO_L18N_T2_A11_D27_14)

## Notes on the sheet
- Power tree
  U3: 1.0 V VCCINT
  U4: 1.8 V VCCAUX
  U5: 3.3 V VCCO/config/VGA/clock
  Add decoupling capacitors near FPGA pins
- X1: 100 MHz oscillator
  Net: CLK100MHZ -> FPGA clock-capable pin
  Power: 3.3 V, GND
- J1: VGA DE-15 connector
  Inputs from FPGA through resistor DAC:
  R[3:0], G[3:0], B[3:0], Hsync, Vsync
- (near SW1) SW1: SW0 slide switch
  Net: SW0 -> FPGA user I/O
  Add pull-up/pull-down resistor
- Custom Artix-7 XC7A100T-CSG324CSobel/VGA board - generated starter schematic
- Replace generic blocks with real symbols/parts, then assign final FPGA ball pins and run ERC.
- J2 + U2: JTAG / QSPI configuration
  JTAG: TCK, TMS, TDI, TDO, VREF, GND
  QSPI: CS_B, CCLK, DQ0..DQ3

## Library data of the parts
C1-C7 C10-C16 C18-C42 C46-C48 C51 C52 C54 C56 C57 C59 C61-C63 C65 C66 = CMP-001-00000-6: Chip Capacitor, 6.8 nF, +/- 10%, 16 V, 0402 (1005 Metric); Capacitor Type: Ceramic; Voltage Rating: 16V; RoHS Compliant: True; Pins: 2; Case/Package: 0402; Min Operating Temperature: -55°C; Tolerance: 10%; Mounting Technology: SM; Max Operating Temperature: 125°C
C8 C9 C17 C44 C45 C49 C50 C53 C55 C60 C64 = CMP-001-00016-6: Chip Capacitor, 10 uF, +/- 10%, 16 V, 1206 (3216 Metric); Capacitor Type: Ceramic; Voltage Rating: 16V; Tolerance: 10%; Min Operating Temperature: -55°C; Pins: 2; Mounting Technology: SM; Case/Package: 1206; Max Operating Temperature: 125°C; RoHS Compliant: True
J1 = CMP-002-00075-1: Hd-D Sub Conn, R/A Rcpt, 15Pos, De, Tht Rohs Compliant: Yes; Gender: Female; Pins: 15; Min Operating Temperature: -55°C; Max Operating Temperature: 105°C
J2 = CMP-002-00076-1: Connector Header Surface Mount 10 position 0.050" (1.27mm)-JTAG Connector; Gender: Female; Max Operating Temperature: 105°C; Min Operating Temperature: -40°C; Pins: 10
J3 = CMP-002-00025-2: Male Header, Pitch 3.96 mm, 1 x 2 Position, Height 10.9 mm, Tail Length 3.7 mm, -25 to 85 degC, RoHS, Bulk; Manufacturer: JST; Case/Package: B2P-VH(LF)(SN); Connector Type: Header; Mounting Technology: TH; Package Reference: B2P-VH(LF)(SN); Package Description: Male Header, Pitch 3.96 mm, 1 x 2 Position, Height 10.9 mm, Tail Length 3.7 mm; Max Operating Temperature: 85°C; Manufacturer URL: http://www.jst.com/home2.html; RoHS Compliant: Unknown; Datasheet Version: May-16; Gender: Male; Min Operating Temperature: -25°C; Datasheet URL: http://www.jst-mfg.com/product/pdf/eng/eVH.pdf
L1-L3 = CMP-006-00019-3: Shielded Wirewound Inductor, 2.2 uH, +/- 20%, -20 to 120 degC, 2-Pin SMD, RoHS, Tape and Reel; Case/Package: SMD/SMT; Pins: 2; Tolerance: 20%
R1-R14 = CMP-009-00056-4: Axial Resistor, 475 Ohm, +/- 1%, 0.25 W, -55 to 155 degC, 2-Pin THD, RoHS, Bulk; Manufacturer: Yageo; Voltage Rating: 250V; Power: 250mW; Case/Package: Axial; Datasheet URL: http://www.yageo.com/documents/recent/Yageo%20LR_MFR_2013.pdf; Tolerance: 1%; RoHS Compliant: True; Mounting Technology: TH; Packaging: Bulk; Package Description: 2-Pin Axial Lead, Dia 2.4 mm, Body Length 6.3 mm; Max Operating Temperature: 155°C; Package Reference: MFR-25; Datasheet Version: Apr-13; Min Operating Temperature: -55°C; Package Quantity: 200; Manufacturer URL: http://www.yageo.com/
R16-R33 = CMP-009-00111-2: 84K5 0.063W 1% 0402 (1005 Metric)  SMD; Power: 63mW; Case/Package: 0402; Mounting Technology: SMT; Pins: 2; Tolerance: 1%
SW1 = CMP-47022-000007-1: SWITCH SLIDE SPDT 4A 125V; Current Rating: 1A; Voltage Rating (DC): 30V; Mechanical Life: 20000Cycles; Contact Resistance: 10mR; Electrical Life: 10000Cycles; Switch Function: On-On; Actuator Material: Nylon; Actuator Length: 6mm; Illumination Type: Non-Illuminated; Switch Travel: 4mm; Actuator Type: Standard; Max Voltage Rating (AC): 250V; Min Operating Temperature: -40°C; Max Voltage Rating (DC): 30V; Contact Current Rating: 4A; Series: 25000N; Termination: PC Pin; Orientation: Right Angle; Contact Plating: Silver; Throw Configuration: SPDT; Max Operating Temperature: 85°C; Contact Material: Silver; Packaging: Bulk; Mount: Through Hole; Voltage Rating (AC): 125V; Package Quantity: 100
U1 = XC7A100T-1CSG324C: IC FPGA ARTIX7 210 I/O 324CSBGA; Manufacturer_Name: AMD; Geometry.Height: 1.5mm; Manufacturer_Part_Number: XC7A100T-1CSG324C; Mouser Part Number: 217-C7A100T-1CSG324C; Mouser Price/Stock: https://www.mouser.co.uk/ProductDetail/Xilinx/XC7A100T-1CSG324C?qs=rrS6PyfT74d56mzbBO3UMQ%3D%3D; Arrow Part Number: *; Arrow Price/Stock: *; Datasheet Link: http://www.xilinx.com/support/documentation/data_sheets/ds181_Artix_7_Data_Sheet.pdf
U2 = CMP-2000-07468-1: Micron Serial NOR Flash Memory, 2.7 to 3.6 V, 128 Mb, -40 to 85 degC, 8-Pin SOP2 (SE), RoHS, Tape and Reel; Mounting Technology: SurfaceMount; Package Reference: SE-8; Package Description: 8-Pin Small Outline Package, Body 5.285 x 5.285 mm, Pitch 1.27 mm; Manufacturer: Micron; Manufacturer URL: http://www.micron.com/; Datasheet URL: https://www.micron.com/~/media/documents/products/data-sheet/nor-flash/serial-nor/mt25q/die-rev-a/mt25q_qlhs_l_128_aba_0.pdf; Datasheet Version: Rev. I , 09/2016; RoHSCompliant: true
U3-U5 = CMP-019-00049-1: 3-V to 17-V, 3-A step-down converter with DCS-control in 3x3 QFN package 16-VQFN -40 to 125; Nominal Supply Current: 17µA; Output Voltage: 6V; Max Supply Voltage: 17V; Min Supply Voltage: 3V; Output Current: 3A; Max Operating Temperature: 125°C; Mounting Technology: Surface Mount; Pins: 16; Min Operating Temperature: -40°C; Case/Package: VQFN
X1 = CMP-00252-66799144-1: DSC1001DL5-100.0000T Oscillator MEMS 100MHz ±10ppm (Stability) 15pF CMOS 55% 1.8V/2.5V/3.3V Automotive 4-Pin CDFN SMD T/R; Operating Supply Voltage: 3.3V; Min Supply Voltage: 1.7V; Max Supply Voltage: 3.6V; Max Supply Current: 8.7mA; Length: 2.4892mm; Frequency Stability: 10ppm; Width: 2.0066mm; Frequency: 100MHz; Termination: Solder; Max Duty Cycle: 55%; Height: 889µm; Case/Package: SMD/SMT; Lifecycle Status: Production; Schedule B: 8542390000, 8542390000; Max Operating Temperature: 105°C; Mount: Standard, Surface Mount; RoHS: Compliant; Ratings: AEC-Q100; Load Capacitance: 15pF; NexarPartId: 66799144; Min Operating Temperature: -40°C